# Altium schematic sheet 1_Power.SchDoc
size A3; DocumentNumber: 2; SheetNumber: 2; SheetTotal: 6
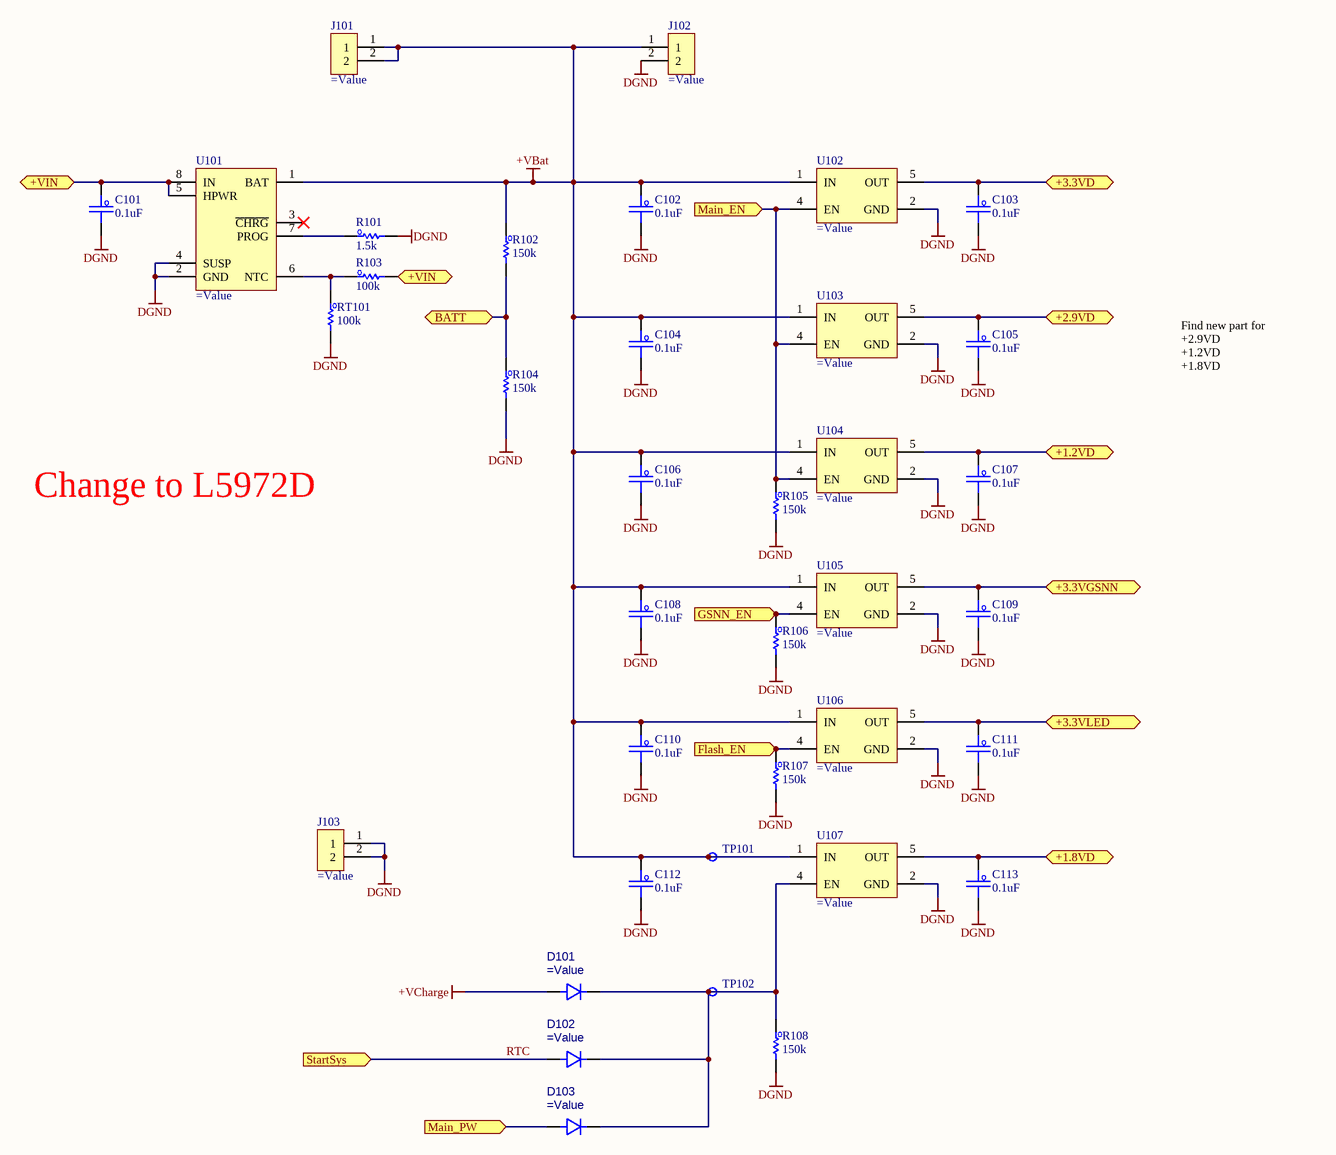
[diagram p0: 1_Power.SchDoc]

## Parts
C101  0.1uF  [C_0603]
C102  0.1uF  [C_0603]
C103  0.1uF  [C_0603]
C104  0.1uF  [C_0603]
C105  0.1uF  [C_0603]
C106  0.1uF  [C_0603]
C107  0.1uF  [C_0603]
C108  0.1uF  [C_0603]
C109  0.1uF  [C_0603]
C110  0.1uF  [C_0603]
C111  0.1uF  [C_0603]
C112  0.1uF  [C_0603]
C113  0.1uF  [C_0603]
D101  (no value)  [DFN119P160X30-2M]
D102  (no value)  [DFN119P160X30-2M]
D103  (no value)  [DFN119P160X30-2M]
J101  (no value)  [Keystone_254]
J102  (no value)  [CON_2P_Header]
J103  (no value)  [Keystone_254]
R101  1.5k  [R_0603]
R102  150k  [R_0603]
R103  100k  [R_0603]
R104  150k  [R_0603]
R105  150k  [R_0603]
R106  150k  [R_0603]
R107  150k  [R_0603]
R108  150k  [R_0603]
RT101  100k  [R_0603]
TP101  (no value)  [TP_Testpoint]  (no BOM)
TP102  (no value)  [TP_Testpoint]  (no BOM)
U101  (no value)  [SON45P200X200X80-9N]  (no BOM)
U102  (no value)  [SOT95P280X145-5N]
U103  (no value)  [SOT95P280X145-5N]
U104  (no value)  [SOT95P280X145-5N]
U105  (no value)  [SOT95P280X145-5N]
U106  (no value)  [SOT95P280X145-5N]
U107  (no value)  [SOT95P280X145-5N]

## Ports
+1.2VD (bidir), +1.8VD (bidir), +2.9VD (bidir), +3.3VD (bidir), +3.3VGSNN (bidir), +3.3VLED (bidir), +VIN (bidir), BATT (bidir), Flash_EN (in), GSNN_EN (in), Main_EN (in), Main_PW (in), StartSys (in)

## Nets
+VBat: C102.1 C104.1 C106.1 C108.1 C110.1 C112.1 J101.1 J101.2 J102.1 R102.1 TP101.1 U101.1(BAT) U102.1(IN) U103.1(IN) U104.1(IN) U105.1(IN) U106.1(IN) U107.1(IN)
+VCharge: D101.2
DGND: C101.2 C102.2 C103.2 C104.2 C105.2 C106.2 C107.2 C108.2 C109.2 C110.2 C111.2 C112.2 C113.2 J102.2 J103.1 J103.2 R101.2 R104.2 R105.2 R106.2 R107.2 R108.2 RT101.2 U101.2(GND) U101.4(SUSP) U102.2(GND) U103.2(GND) U104.2(GND) U105.2(GND) U106.2(GND) U107.2(GND)
+1.2VD: C107.1 U104.5(OUT) ; port +1.2VD
+1.8VD: C113.1 U107.5(OUT) ; port +1.8VD
+2.9VD: C105.1 U103.5(OUT) ; port +2.9VD
+3.3VD: C103.1 U102.5(OUT) ; port +3.3VD
+3.3VGSNN: C109.1 U105.5(OUT) ; port +3.3VGSNN
+3.3VLED: C111.1 U106.5(OUT) ; port +3.3VLED
+VIN: C101.1 R103.2 U101.5(HPWR) U101.8(IN) ; port +VIN
BATT: R102.2 R104.1 ; port BATT
Flash_EN: R107.1 U106.4(EN) ; port Flash_EN
GSNN_EN: R106.1 U105.4(EN) ; port GSNN_EN
Main_EN: R105.1 U102.4(EN) U103.4(EN) U104.4(EN) ; port Main_EN
Main_PW: D103.2 ; port Main_PW
RTC: D102.2 ; port StartSys
NetD101_1: D101.1 D102.1 D103.1 R108.1 TP102.1 U107.4(EN)
NetR101_1: R101.1 U101.7(PROG)
NetR103_1: R103.1 RT101.1 U101.6(NTC)

Not connected (* = marked no-connect by the designer): U101 3(~{CHRG})*

## Notes on the sheet
- Find new part for
  +2.9VD
  +1.2VD
  +1.8VD
- Change to L5972D
- Title :
- Revision :
- ผู้จัดทำ:
- Size:
- A3
- Time:
- ผู้เขียน:
- บริษัท ยูนิเวอร์แซล ยูทีลิตี้ส์ จำกัด (มหาชน) เลขที่ 1 อาคาร อีสท์วอเตอร์ ชั้น 18 ซอยวิภาวดีรังสิต 5 แขวงจอมพล เขตจตุจักร กรุงเทพฯ 10900
  Tel : +662-272-1688
  Fax :+662-2721690-1
- -
- Sheet:
- of
- ผู้อำนวยการ
- ผู้ตรวจสอบ:
- Number:
- กรรมการผู้จัดการ:
- File:

## Library data of the parts
C101-C113 = C_Capacitor: CAP CER 0.1UF 50V X7R 0603; Manufacturer: KEMET; PartNumber: C0603C104K5RACTU; PackageReference: 0603; PartID: 399-5089-1-ND; Value2: 50V; Value: 0.1uF; Value3: *
D101-D103 = D_PW_VSKY20301608: DIODE SCHOTTKY 30V 2A 0603; Manufacturer: Vishay General Semiconductor - Diodes Division; Value: VSKY20301608-G4-08; PackageReference: 0603; PartID: 112-VSKY20301608-G4-08CT-ND; PartNumber: VSKY20301608-G4-08
J101 J103 = CON_BAT_254: BATT CONTACT CLIP 18650 1CEL SMD; PartNumber: 254; Manufacturer: Keystone Electronics; Value: 254; PartID: 36-254-ND; PackageReference: *; Value3: *
J102 = CON_2P_Heder: Connector 2 position; PartNumber: 796866-2; Manufacturer: TE Connectivity AMP Connectors; Value: 796866-2; PartID: A98302-ND; PackageReference: TERM BLOCK; Value3: *
R101 = R_Resister: RES 1.5K OHM 5% 1/10W 0603; Manufacturer: Vishay Dale; PartNumber: CRCW06031K50JNEAC; Value2: 0.1W; Value: 1.5k; PackageReference: 0603; PartID: 541-CRCW06031K50JNEACCT-ND; Value3: *
R102 R104-R108 = R_Resister: RES SMD 150K OHM 1% 1/10W 0603; Manufacturer: Vishay Dale; PartNumber: CRCW0603150KFKEAC; Value2: 0.1W; Value: 150k; PackageReference: 0603; PartID: 541-4034-1-ND; Value3: *
R103 RT101 = R_Resister: RES 1.5K OHM 5% 1/10W 0603; Manufacturer: Vishay Dale; Value: 100k; PackageReference: 0603; Value3: *
TP101 TP102 = TP_TestPoint: TestPoint; Manufacturer: *; PackageReference: *; PartID: *; PartNumber: *; Value2: *; Value3: *
U101 = IC_PMS_LTC4095: IC BATT CHG LI-ION 1CELL 8DFN; PartNumber: LTC4095EDC#TRMPBF; Manufacturer: Analog Devices Inc.; Value: LTC4095EDC#TRMPBF; PartID: LTC4095EDC#TRMPBFCT-ND; PackageReference: DFN-8; Value2: *; Value3: *
U102-U107 = IC_LDO_RT9069-33GB: 200mA 360mV@(10mA) Fixed 3.3V~3.3V Positive 1 36V SOT-23-5 Linear Voltage Regulators (LDO) ROHS; Manufacturer: Richtek Tech; PartNumber: RT9069-33GB; PartID: C147969; PackageReference: SOT-23-5; Value: RT9069-33GB; Value2: *; Value3: *